# EAGLE schematic schema_21 (EAGLE 9.0.0)
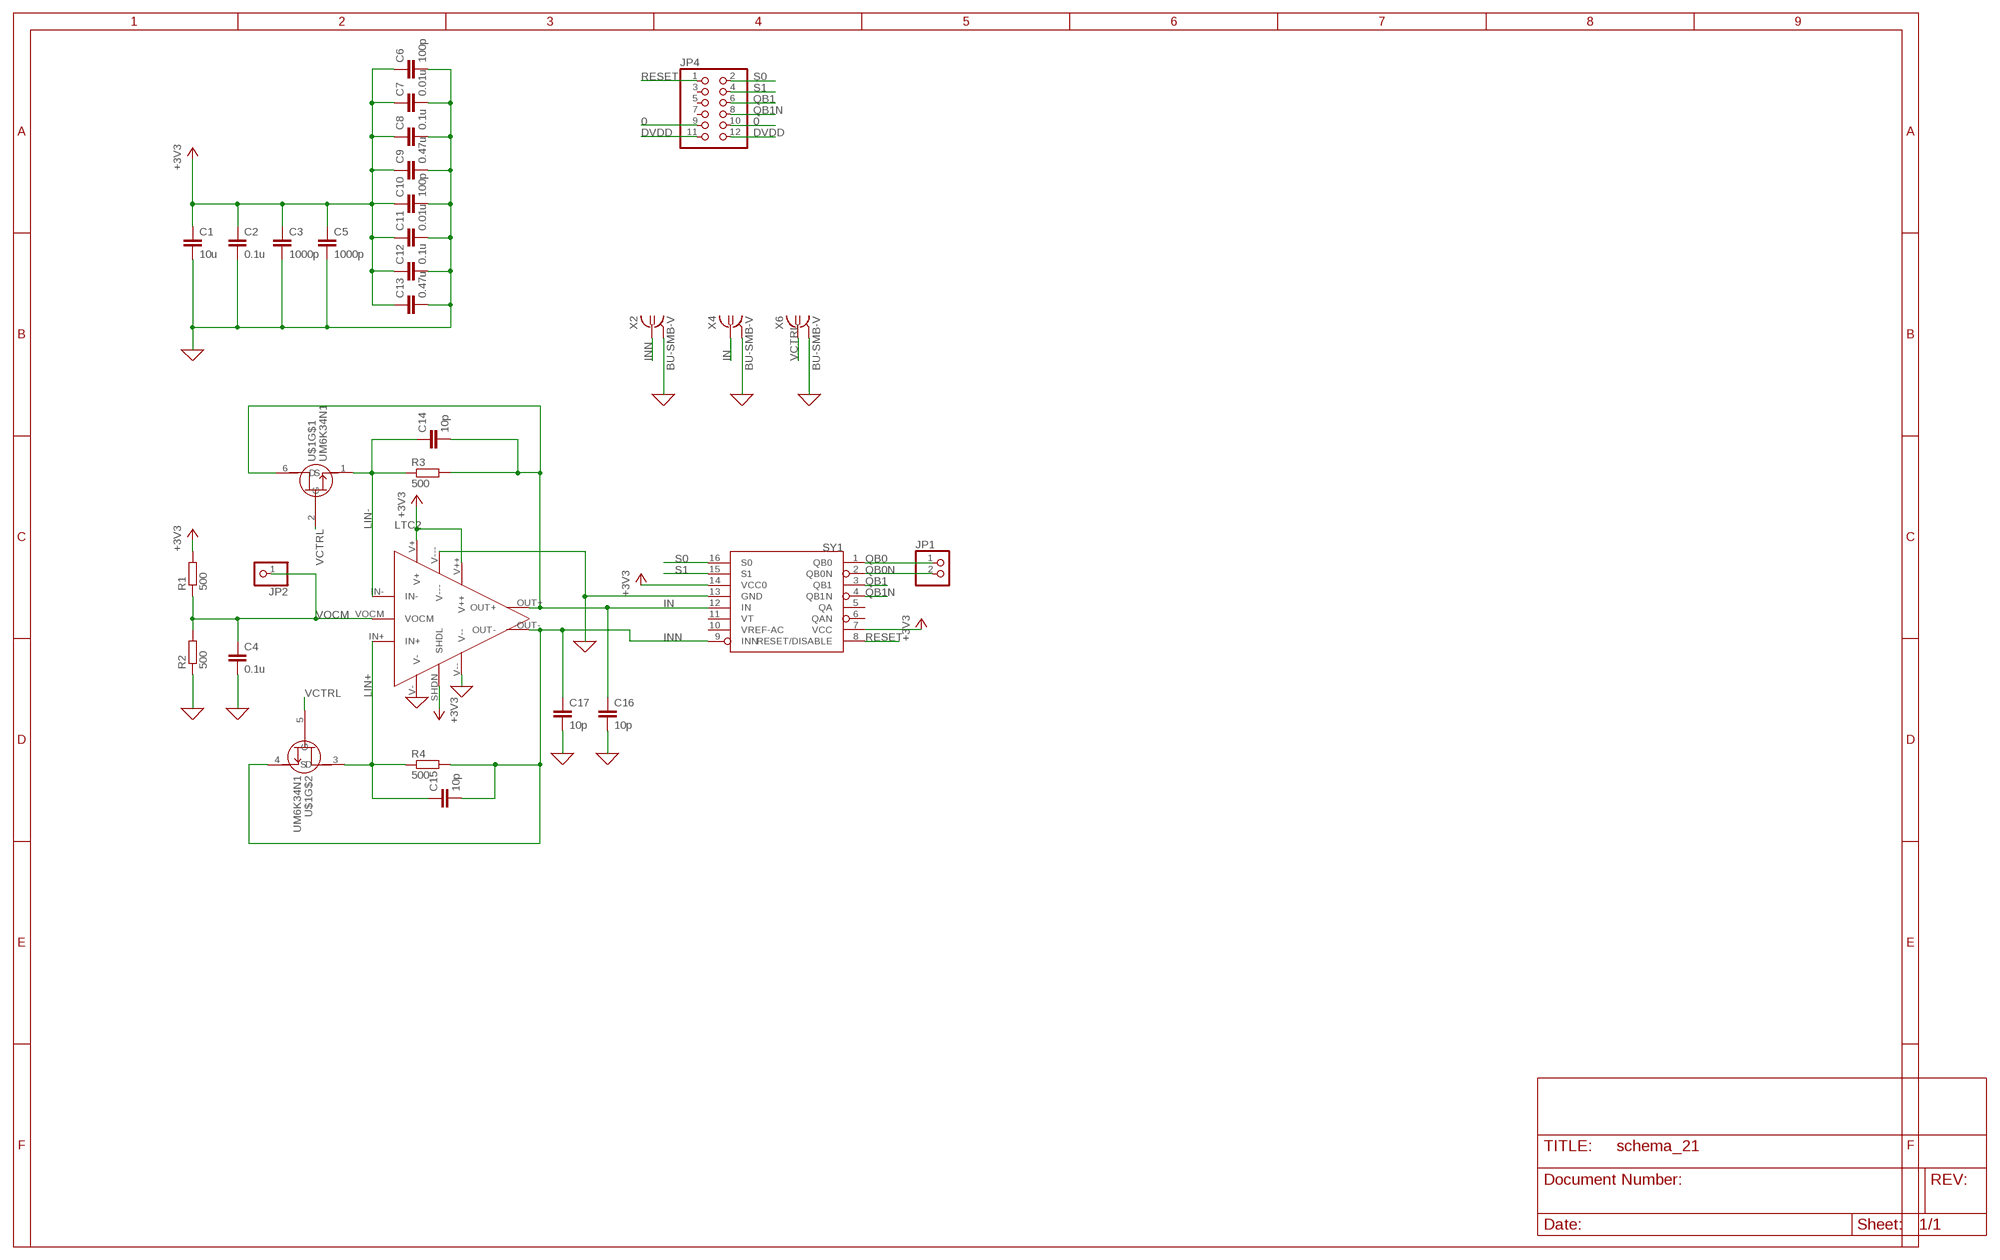
[diagram p0: schematic, sheet 1]

## Parts
C1  10u  C-EUC1210  [C1210]
C2  0.1u  C-EUC0603  [C0603]
C3  1000p  C-EUC1206  [C1206]
C4  0.1u  C-EUC0603  [C0603]
C5  1000p  C-EUC1206  [C1206]
C6  100p  C-EUC0805  [C0805]
C7  0.01u  C-EUC1808  [C1808]
C8  0.1u  C-EUC0603  [C0603]
C9  0.47u  C-EUC1210  [C1210]
C10  100p  C-EUC0805  [C0805]
C11  0.01u  C-EUC1808  [C1808]
C12  0.1u  C-EUC0603  [C0603]
C13  0.47u  C-EUC1210  [C1210]
C14  10p  C-EUC0603  [C0603]
C15  10p  C-EUC0603  [C0603]
C16  10p  C-EUC0603  [C0603]
C17  10p  C-EUC0603  [C0603]
JP1  PINHD-1X2  [1X02]
JP2  0  PINHD-1X1  [1X01]
JP4  0  PINHD-2X6/90  [2X06/90]
LTC2  0  LTC6409_1  [LTC6409_1]
R1  500  R-EU_R0603  [R0603]
R2  500  R-EU_R0603  [R0603]
R3  500  R-EU_R0603  [R0603]
R4  500  R-EU_R0603  [R0603]
SY1  SY89873LN  [QFN50P300X300X90-16]
U$1  UM6K34N1  [SOTFL65P210X100-6]
X2  BU-SMB-V  [BU-SMB-V]
X4  BU-SMB-V  [BU-SMB-V]
X6  BU-SMB-V  [BU-SMB-V]

## Nets
0: C1.2 C2.2 C3.2 C4.2 C5.2 C6.2 C7.2 C8.2 C9.2 C10.2 C11.2 C12.2 C13.2 C16.2 C17.2 JP4.9 JP4.10 LTC2.V- LTC2.V-- LTC2.V--- R2.1 SY1.13(GND) X2.2 X2.3 X2.4 X2.5 X4.2 X4.3 X4.4 X4.5 X6.2 X6.3 X6.4 X6.5 ; supply symbol labelled GND
+3V3: C1.1 C2.1 C3.1 C5.1 C6.1 C7.1 C8.1 C9.1 C10.1 C11.1 C12.1 C13.1 LTC2.SHDN(SHDL) LTC2.V+ LTC2.V++ R1.2 SY1.7(VCC) SY1.14(VCC0)
DVDD: JP4.11 JP4.12
IN: C14.2 C16.1 LTC2.OUT+ R3.2 SY1.12(IN) U$1.6(D) X4.1
INN: C15.2 C17.1 LTC2.OUT- R4.2 SY1.9(INN) U$1.4(S) X2.1
LIN+: C15.1 LTC2.IN+ R4.1 U$1.3(D)
LIN-: C14.1 LTC2.IN- R3.1 U$1.1(S)
QB0: JP1.1 SY1.1(QB0)
QB0N: JP1.2 SY1.2(QB0N)
QB1: JP4.6 SY1.3(QB1)
QB1N: JP4.8 SY1.4(QB1N)
RESET: JP4.1 SY1.8(RESET/DISABLE)
S0: JP4.2 SY1.16(S0)
S1: JP4.4 SY1.15(S1)
VCTRL: U$1.2(G) U$1.5(G) X6.1
VOCM: C4.1 JP2.1 LTC2.VOCM R1.1 R2.2
Unconnected: JP4.3 JP4.5 JP4.7 SY1.5(QA) SY1.6(QAN) SY1.10(VREF-AC) SY1.11(VT)

## Library data of the parts
C1-C3 C5-C13 = rcl:C-EU: CAPACITOR, European symbol
C4 C14-C17 = rcl:C-EU: CAPACITOR, European symbol; SPICEPREFIX: C
JP1 = pinhead:PINHD-1X2: PIN HEADER
JP2 = pinhead:PINHD-1X1: PIN HEADER
JP4 = pinhead:PINHD-2X6: PIN HEADER
LTC2 = mylibrary:LTC6409_1
R1 R2 = rcl:R-EU_: RESISTOR, European symbol; SPICEPREFIX: R
R3 R4 = resistor:R-EU_: RESISTOR, European symbol
SY1 = mylibrary:SY89873L
U$1 = mylibrary:UM6K34N1
X2 X4 X6 = con-coax:BU-SMB-V: FEMALE SMB CONNECTOR Radiall distributor RS 112-2993; OC_FARNELL: unknown; OC_NEWARK: unknown